# Altium schematic sheet CLK_INPUT.SchDoc: Phaser
size 420 x 297 mm; EDA_Number: ARTIQ; Projet: ARTIQ/SINARA; Author: G.Kasprowicz; CompanyName: WUT ISE; DrawnBy: G.Kasprowicz; Organization: WUT ISE; Address1: PW ISE; Address2: Nowowiejska 15/19 00-665 Warsaw; Address3: gkasprow@gmail.com; DocumentNumber: 5; Revision: 2; SheetNumber: 5; SheetTotal: 18; ModifiedBy: -; CheckedDate: -; Title2: Clock distribution; DivGrp: WUT ISE; Designer: G.Kasprowicz; ModifiedDate: -; ProjectName: Sensor Box
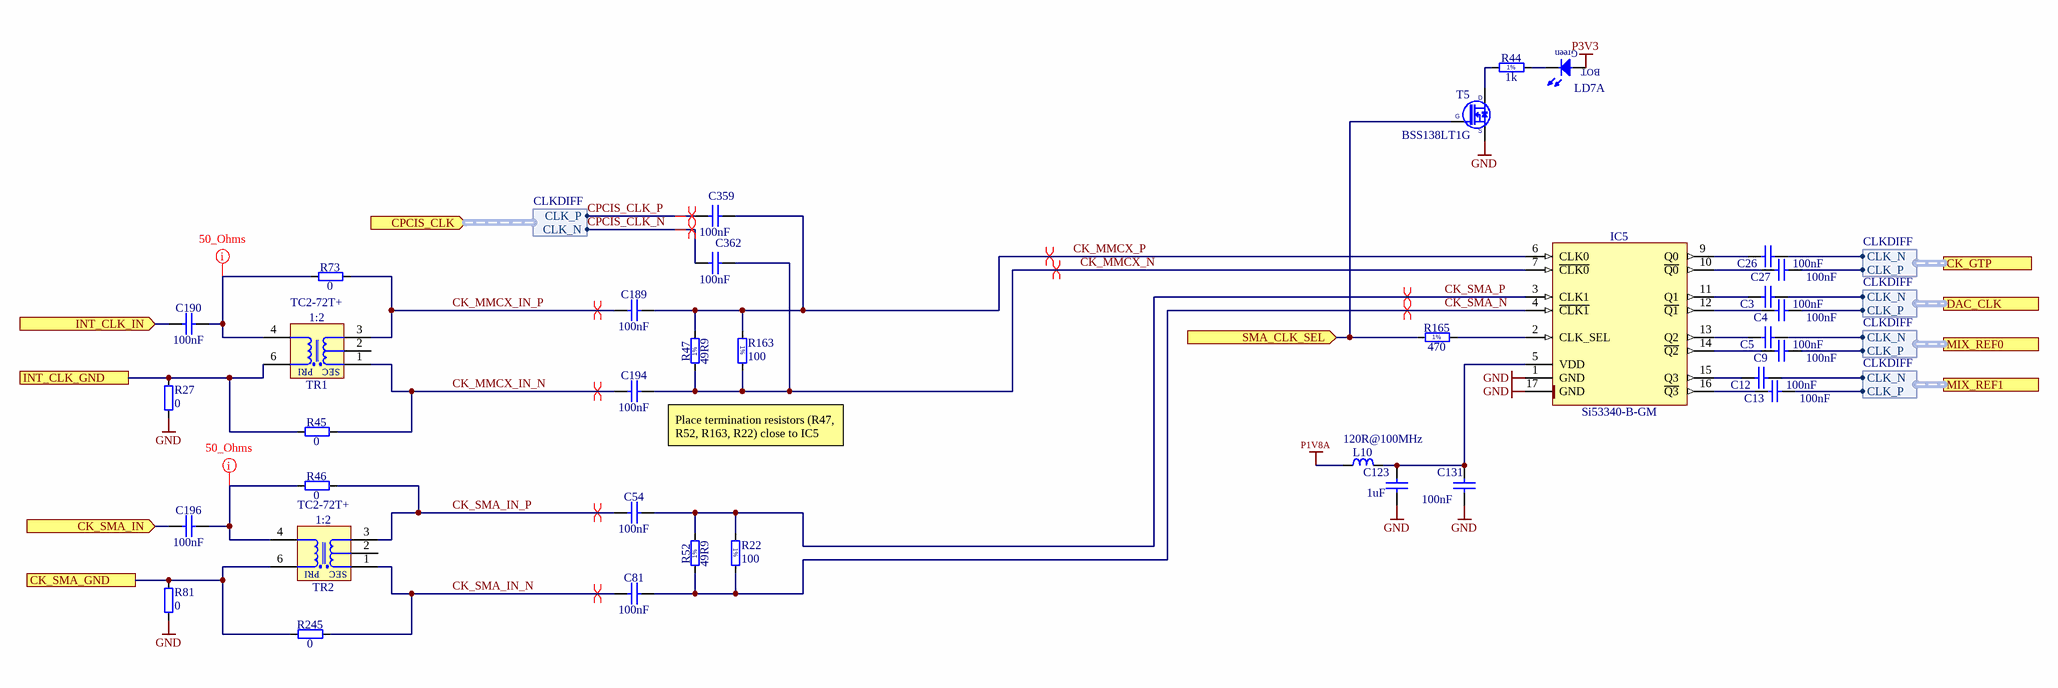
[diagram p0: CLK_INPUT.SchDoc]

## Parts
C3  100nF  [CAPC1005X55N]
C4  100nF  [CAPC1005X55N]
C5  100nF  [CAPC1005X55N]
C9  100nF  [CAPC1005X55N]
C12  100nF  [CAPC1005X55N]
C13  100nF  [CAPC1005X55N]
C26  100nF  [CAPC1005X55N]
C27  100nF  [CAPC1005X55N]
C54  100nF  [CAPC1005X55N]
C81  100nF  [CAPC1005X55N]
C123  1uF  [CAPC1005X55N]
C131  100nF  [CAPC1005X55N]
C189  100nF  [CAPC1005X55N]
C190  100nF  [CAPC1005X55N]
C194  100nF  [CAPC1005X55N]
C196  100nF  [CAPC1005X55N]
C359  100nF  [CAPC1005X55N]
C362  100nF  [CAPC1005X55N]
IC5  Si53340-B-GM  [QFN50P300X300X90-17N-S175]
L10  120R@100MHz  [INDC1608X95N]
LD7  Red/Green  [LED_DIALIGHT_571-0112F]  (value not drawn)  (part A of 2)
R22  100  [RESC1005X40N]
R27  0  [RESC1005X40N]
R44  1k  [RESC1005X40N]
R45  0  [RESC1005X40N]
R46  0  [RESC1005X40N]
R47  49R9  [RESC1005X40N]
R52  49R9  [RESC1005X40N]
R73  0  [RESC1005X40N]
R81  0  [RESC1005X40N]
R163  100  [RESC1005X40N]
R165  470  [RESC1005X40N]
R245  0  [RESC1005X40N]
T5  BSS138LT1G  [SOT95P240X110-3N]
TR1  1:2  Manufacturer Part Number: TC2-72T+  [XFMR_MINI-CIRCUITS_AT1521]
TR2  1:2  Manufacturer Part Number: TC2-72T+  [XFMR_MINI-CIRCUITS_AT1521]

## Ports
CK_GTP (harness CLKDIFF), CK_SMA_GND, CK_SMA_IN (in), CPCIS_CLK (in, harness CLKDIFF), DAC_CLK (harness CLKDIFF), INT_CLK_GND, INT_CLK_IN (in), MIX_REF0 (harness CLKDIFF), MIX_REF1 (harness CLKDIFF), SMA_CLK_SEL (in)

## Harnesses
CLKDIFF: CLK_N, CLK_P

## Nets
GND: C123.1 C131.1 IC5.1(GND) IC5.17(GND) R27.1 R81.1 T5.2(S)
P1V8A: L10.2
P3V3: LD7.2(A)
CK_MMCX_IN_N: C194.1 R45.2 TR1.1(SDOT)
CK_MMCX_IN_P: C189.1 R73.2 TR1.3(S)
CK_MMCX_N: C194.2 C362.2 IC5.7(~{CLK0}) R47.1 R163.2
CK_MMCX_P: C189.2 C359.2 IC5.6(CLK0) R47.2 R163.1
CK_SMA_GND: R81.2 R245.1 TR2.6(PDOT) ; port CK_SMA_GND
CK_SMA_IN: C196.1 ; port CK_SMA_IN
CK_SMA_IN_N: C81.1 R245.2 TR2.1(SDOT)
CK_SMA_IN_P: C54.1 R46.2 TR2.3(S)
CK_SMA_N: C81.2 IC5.4(~{CLK1}) R22.2 R52.1
CK_SMA_P: C54.2 IC5.3(CLK1) R22.1 R52.2
CPCIS_CLK_N: C362.1 ; port CPCIS_CLK.CLK_N
CPCIS_CLK_P: C359.1 ; port CPCIS_CLK.CLK_P
INT_CLK_GND: R27.2 R45.1 TR1.6(PDOT) ; port INT_CLK_GND
INT_CLK_IN: C190.1 ; port INT_CLK_IN
SMA_CLK_SEL: R165.1 T5.1(G) ; port SMA_CLK_SEL
NetC3_1: C3.1 IC5.11(Q1)
NetC3_2: C3.2 ; port DAC_CLK.CLK_N
NetC4_1: C4.1 IC5.12(~{Q1})
NetC4_2: C4.2 ; port DAC_CLK.CLK_P
NetC5_1: C5.1 IC5.13(Q2)
NetC5_2: C5.2 ; port MIX_REF0.CLK_N
NetC9_1: C9.1 IC5.14(~{Q2})
NetC9_2: C9.2 ; port MIX_REF0.CLK_P
NetC12_1: C12.1 IC5.15(Q3)
NetC12_2: C12.2 ; port MIX_REF1.CLK_N
NetC13_1: C13.1 IC5.16(~{Q3})
NetC13_2: C13.2 ; port MIX_REF1.CLK_P
NetC26_1: C26.1 IC5.9(Q0)
NetC26_2: C26.2 ; port CK_GTP.CLK_N
NetC27_1: C27.1 IC5.10(~{Q0})
NetC27_2: C27.2 ; port CK_GTP.CLK_P
NetC123_2: C123.2 C131.2 IC5.5(VDD) L10.1
NetC190_2: C190.2 R73.1 TR1.4(P)
NetC196_2: C196.2 R46.1 TR2.4(P)
NetIC5_2: IC5.2(CLK_SEL) R165.2
NetLD7_1: LD7.1(C) R44.2
NetR44_1: R44.1 T5.3(D)

Not connected (* = marked no-connect by the designer): TR1 2(NC); TR2 2(NC)

## Layout directives
differential pair: CK_MMCX_IN_N, CK_MMCX_IN_P, CK_MMCX_N, CK_MMCX_P, CK_SMA_IN_N, CK_SMA_IN_P, CK_SMA_N, CK_SMA_P, CPCIS_CLK_N, CPCIS_CLK_P
net class 50_Ohms: NetC190_2, NetC196_2

## Notes on the sheet
- Place termination resistors (R47, R52, R163, R22) close to IC5
- Project/Equipment
- Document
- Designer
- Drawn by
- Check.by
- Copyright WUT ISE 2018.
  This documentation describes Open Hardware and is licensed under the CERN OHL v.1.1. You may redistribute and modify this documentation under the terms of the CERN OHL v.1.1. (http://ohwr.org/CERNOHL). This documentation is distributed WITHOUT ANY EXPRESS OR IMPLIED WARRANTY, INCLUDING OF MERCHANTABILITY, SATISFACTORY QUALITY AND FITNESS FOR A PARTICULAR PURPOSE. Please see the CERN OHL v.1.1 for applicable conditions.
- Contact
- File
- Last Mod.
- Print Date
- Sheet
- Size
- A3
- of
- Rev
- (in symbol LED_DIALIGHT_571-0112F, part A) Green; BOT
- (in symbol R0402_1K_1%_0.0625W_100PPM) 1%
- (in symbol R0402_49R9_1%_0.0625W_100PPM) 1%
- (in symbol R0402_100R_1%_0.0625W_100PPM) 1%
- (in symbol R0402_470R_1%_0.0625W_100PPM) 1%
- (in symbol XFMR_MINI-CIRCUITS_TC2-72T+) PRI; SEC

## Library data of the parts
C3-C5 C9 C12 C13 C26 C27 C54 C81 C131 C189 C190 C194 C196 C359 C362 = CC0402_100NF_16V_10%_X5R: Non-polarised capacitor; Part Description: SMD Multilayer Chip Ceramic Capacitor; Manufacturer: GENERIC; Manufacturer1 Part Number: GRM155R61C104KA88D; Voltage: 16V; TC: X5R; Tolerance: ±10%; Part Number: CC0402_100NF_16V_10%_X5R; Component Kind: Standard; Component Type: Standard; Pin Count: 2; Value: 100nF; Status: None; Manufacturer Part Number: CC0402_100NF_16V_10%_X5R; Case: 0402; Mounted: Yes; Socket: No; SMD: Yes; Sense: No; Manufacturer1 Example: MURATA; Manufacturer1 ComponentHeight: 0.55mm; HelpURL: \\cern.ch\dfs\Applications\Altium\Datasheets\CC0402_X5R_MURATA_GRM.pdf; Author: CERN DEM JLC; CreateDate: 10.12.2013; LatestRevisionDate: 10.12.2013
C123 = CC0402_1UF_16V_10%_X5R: Non-polarised capacitor; Part Description: SMD Multilayer Chip Ceramic Capacitor; Manufacturer: GENERIC; Manufacturer1 Part Number: C1005X5R1C105KT; Voltage: 16V; TC: X5R; Tolerance: ±10%; Part Number: CC0402_1UF_16V_10%_X5R; Component Kind: Standard; Component Type: Standard; Pin Count: 2; Value: 1uF; Status: Preferred; Manufacturer Part Number: CC0402_1UF_16V_10%_X5R; Case: 0402; Mounted: Yes; Socket: No; SMD: Yes; Sense: No; Manufacturer1 Example: TDK; Manufacturer1 ComponentHeight: 0.55mm; HelpURL: \\cern.ch\dfs\Applications\Altium\Datasheets\CC0402_X5R_TDK_C.pdf; Author: CERN DEM JLC; CreateDate: 2012-10-25; LatestRevisionDate: 2012-10-25
IC5 = Si53340-B-GM: Low-Jitter LVDS Fanout Clock Buffers, 10-Output,  Any-Input, Any-Frequency up to 1250MHz; Manufacturer: SILICON LABS; PressFit: No; Bonding: No; Part Number: Si53340-B-GM; Component Kind: Standard; Component Type: Standard; Device: Si53340-B-GM; PackageDescription: QFN, 0.50mm Pitch, Square; 16 Pin, 3.00mm L X 3.00mm W X 0.90mm H Body (w/thermal tab 1.75mm x 1.75mm), IPC Medium Density; Part Description: Low-Jitter LVDS Fanout Clock Buffers, 10-Output,  Any-Input, Any-Frequency up to 1250MHz; Manufacturer Part Number: Si53340-B-GM; Pin Count: 17; Case: QFN16; Mounted: Yes; Socket: No; SMD: Yes; Sense: No; ComponentHeight: 0.9mm; HelpURL: \\cern.ch\dfs\Applications\Altium\Datasheets\Si53340-B-GM.pdf; Author: CERN DEM MR; CreateDate: 04.09.2017; LatestRevisionDate: 04.09.2017
L10 = IND0603_MURATA_BLM18PG121SN1D: Inductor; Part Description: SMD EMIFIL Chip Ferrite Bead; Manufacturer: MURATA; Power: 2A; Resistance: 0.05R; Part Number: IND0603_MURATA_BLM18PG121SN1D; Component Kind: Standard; Component Type: Standard; Pin Count: 2; Value: 120R@100MHz; Status: None; Manufacturer Part Number: BLM18PG121SN1D; Case: 0603; Mounted: Yes; Socket: No; SMD: Yes; Sense: No; ComponentHeight: 0.95mm; HelpURL: \\cern.ch\dfs\Applications\Altium\Datasheets\IND0603_MURATA_BLM18P.pdf; Author: CERN DEM BC; CreateDate: 2015-07-27; LatestRevisionDate: 2015-07-27
LD7 = LED_DIALIGHT_571-0112F: 2x LED  Botom Green, Top Red; Part Description: Dual 2mm  LEDs, Red Top,Green Bot, CBI® Circuit Board Indicator (Without positioning pins); PressFit: No; Bonding: No; Part Number: LED_DIALIGHT_571-0112F; Component Kind: Standard; Component Type: Standard; Color: Red/Green; PackageDescription: 2x 2mm LED (Top: Red, Bot: Green) PCB Edge Mounting (Without positioning pins) DIALIGHT 571 Serie; Manufacturer: DIALIGHT; Manufacturer Part Number: 571-0112F; Pin Count: 4; Mounted: Yes; Socket: No; SMD: No; Sense: No; ComponentHeight: 8.6mm; HelpURL: \\cern.ch\dfs\Applications\Altium\Datasheets\LED_DIALIGHT_571-0112F.pdf; Author: CERN DEM JLC; CreateDate: 09.11.2009; LatestRevisionDate: 17.03.2010
R22 R163 = R0402_100R_1%_0.0625W_100PPM: Resistor - 1%; Part Description: General Purpose Thick Film Chip Resistor; Manufacturer: GENERIC; Manufacturer1 Part Number: 232270671001L; TC: ±100ppm/°C; PressFit: No; Part Number: R0402_100R_1%_0.0625W_100PPM; Component Kind: Standard; Component Type: Standard; Pin Count: 2; Value: 100; Status: Not Recommended; Power: 0.0625W; Tolerance: ±1%; Manufacturer Part Number: R0402_100R_1%_0.0625W_100PPM; Case: 0402; Mounted: Yes; Sense: No; Socket: No; SMD: Yes; Manufacturer1 Example: YAGEO PHYCOMP; Manufacturer1 ComponentHeight: 0.4mm; HelpURL: \\cern.ch\dfs\Applications\Altium\Datasheets\R0402_Phycomp_RC0402.pdf; Author: CERN DEM JLC; CreateDate: 03.12.2007; LatestRevisionDate: 17.10.2012
R27 R45 R46 R73 R81 R245 = R0402_0R_JUMPER: Resistor; Part Description: 1A (0.05R Max DC Resistance) Zero Ohm Jumper; Manufacturer: GENERIC; Manufacturer1 Part Number: 232270591001L; PressFit: No; Part Number: R0402_0R_JUMPER; Component Kind: Standard; Component Type: Standard; Pin Count: 2; Value: 0; Status: Not Recommended; Manufacturer Part Number: R0402_0R_JUMPER; Case: 0402; Mounted: Yes; Sense: No; Socket: No; SMD: Yes; Manufacturer1 Example: YAGEO PHYCOMP; Manufacturer1 ComponentHeight: 0.4mm; HelpURL: \\cern.ch\dfs\Applications\Altium\Datasheets\R0402_Phycomp_RC0402.pdf; Author: CERN DEM JLC; CreateDate: 03.12.2007; LatestRevisionDate: 17.10.2012
R44 = R0402_1K_1%_0.0625W_100PPM: Resistor - 1%; Part Description: General Purpose Thick Film Chip Resistor; Manufacturer: GENERIC; Manufacturer1 Part Number: 232270671002L; TC: ±100ppm/°C; PressFit: No; Part Number: R0402_1K_1%_0.0625W_100PPM; Component Kind: Standard; Component Type: Standard; Pin Count: 2; Value: 1k; Status: Not Recommended; Power: 0.0625W; Tolerance: ±1%; Manufacturer Part Number: R0402_1K_1%_0.0625W_100PPM; Case: 0402; Mounted: Yes; Sense: No; Socket: No; SMD: Yes; Manufacturer1 Example: YAGEO PHYCOMP; Manufacturer1 ComponentHeight: 0.4mm; HelpURL: \\cern.ch\dfs\Applications\Altium\Datasheets\R0402_Phycomp_RC0402.pdf; Author: CERN DEM JLC; CreateDate: 03.12.2007; LatestRevisionDate: 17.10.2012
R47 R52 = R0402_49R9_1%_0.0625W_100PPM: Resistor - 1%; Part Description: General Purpose Thick Film Chip Resistor; Manufacturer: GENERIC; Manufacturer1 Part Number: 232270674999L or RC0402FR-0749R9L; TC: ±100ppm/°C; PressFit: No; Part Number: R0402_49R9_1%_0.0625W_100PPM; Component Kind: Standard; Component Type: Standard; Pin Count: 2; Value: 49R9; Status: Not Recommended; Power: 0.0625W; Tolerance: ±1%; Manufacturer Part Number: R0402_49R9_1%_0.0625W_100PPM; Case: 0402; Mounted: Yes; Sense: No; Socket: No; SMD: Yes; Manufacturer1 Example: YAGEO PHYCOMP; Manufacturer1 ComponentHeight: 0.4mm; HelpURL: \\cern.ch\dfs\Applications\Altium\Datasheets\R0402_Phycomp_RC0402.pdf; Author: CERN DEM JLC; CreateDate: 24.10.2012; LatestRevisionDate: 24.10.2012
R165 = R0402_470R_1%_0.0625W_100PPM: Resistor - 1%; Part Description: General Purpose Thick Film Chip Resistor; Manufacturer: GENERIC; Manufacturer1 Part Number: 232270674701L; TC: ±100ppm/°C; PressFit: No; Part Number: R0402_470R_1%_0.0625W_100PPM; Component Kind: Standard; Component Type: Standard; Pin Count: 2; Value: 470; Status: Not Recommended; Power: 0.0625W; Tolerance: ±1%; Manufacturer Part Number: R0402_470R_1%_0.0625W_100PPM; Case: 0402; Mounted: Yes; Sense: No; Socket: No; SMD: Yes; Manufacturer1 Example: YAGEO PHYCOMP; Manufacturer1 ComponentHeight: 0.4mm; HelpURL: \\cern.ch\dfs\Applications\Altium\Datasheets\R0402_Phycomp_RC0402.pdf; Author: CERN DEM JLC; CreateDate: 03.12.2007; LatestRevisionDate: 17.10.2012
T5 = BSS138LT1G: N-CHANNEL MOSFET WITH DIODE; Part Description: 50V 200mA N-Channel Enhancement Mode Field-Effect Transistor; Manufacturer: ON SEMICONDUCTOR; PressFit: No; Bonding: No; Part Number: BSS138LT1G; Component Kind: Standard; Component Type: Standard; Device: BSS138LT1G; PackageDescription: SOT23 3-Leads, Pitch 0.95mm - Body 1.4x3mm, IPC Medium Density; Manufacturer Part Number: BSS138LT1G; Pin Count: 3; Case: SOT23-3; Mounted: Yes; Socket: No; SMD: Yes; Sense: No; ComponentHeight: 1.11mm; HelpURL: \\cern.ch\dfs\Applications\Altium\Datasheets\BSS138LT1G.pdf; Author: CERN DEM JLC; CreateDate: 23.03.2009; LatestRevisionDate: 23.03.2009
TR1 TR2 = XFMR_MINI-CIRCUITS_TC2-72T+: 50 Ohms 10 to 700 MHzz RF Transformer; Part Description: 50 Ohms 10 to 700MHz RF Transformer; Manufacturer: MINI-CIRCUITS; HelpURL: \\cern.ch\dfs\Applications\Altium\Datasheets\XFMR_MINI-CIRCUITS_TC2-1TX+.pdf; Part Number: XFMR_MINI-CIRCUITS_TC2-72T+; Component Kind: Standard; Component Type: Standard; Pin Count: 5; Value: 1:2; Status: None; Mounted: Yes; Socket: No; Sense: No; SMD: Yes; ComponentHeight: 4.06mm; Author: GK; CreateDate: 18.10.2019; LatestRevisionDate: 18.10.2019